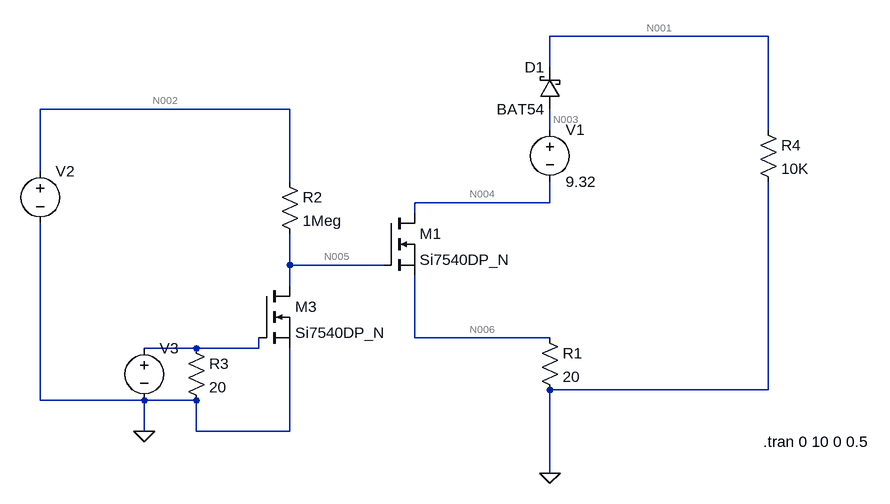
[diagram p0: schematic 1_solar_bank_cutoff_simu.asc]
1_solar_bank_cutoff_simu.asc, the LTspice schematic file:
Version 4
SHEET 1 880 680
WIRE 496 -96 160 -96
WIRE 160 -48 160 -96
WIRE -240 16 -624 16
WIRE 160 48 160 16
WIRE 496 48 496 -96
WIRE -624 112 -624 16
WIRE -240 128 -240 16
WIRE 160 160 160 128
WIRE 160 160 -48 160
WIRE -48 176 -48 160
WIRE -240 256 -240 208
WIRE -96 256 -240 256
WIRE -240 288 -240 256
WIRE -48 368 -48 272
WIRE 160 368 -48 368
WIRE -384 384 -464 384
WIRE -288 384 -288 368
WIRE -288 384 -384 384
WIRE 496 448 496 128
WIRE 496 448 160 448
WIRE -624 464 -624 192
WIRE -464 464 -624 464
WIRE -384 464 -464 464
WIRE -464 512 -464 464
WIRE -384 512 -384 464
WIRE -240 512 -240 384
WIRE -240 512 -384 512
WIRE 160 576 160 448
FLAG 160 576 0
FLAG -464 512 0
SYMBOL voltage 160 32 R0
WINDOW 123 0 0 Left 0
WINDOW 39 0 0 Left 0
SYMATTR InstName V1
SYMATTR Value 9.32
SYMBOL res 144 352 R0
SYMATTR InstName R1
SYMATTR Value 20
SYMATTR SpiceLine tol=1 pwr=0.1
SYMBOL nmos -288 288 R0
SYMATTR InstName M3
SYMATTR Value Si7540DP_N
SYMBOL schottky 176 16 R180
WINDOW 0 24 64 Left 2
WINDOW 3 24 0 Left 2
SYMATTR InstName D1
SYMATTR Value BAT54
SYMBOL voltage -464 368 R0
WINDOW 3 24 96 Invisible 2
WINDOW 39 0 0 Left 0
SYMATTR Value PULSE(0 3.3 0 0 0 1 2 10)
SYMATTR InstName V3
SYMATTR Value2 AC 1
SYMBOL res -256 112 R0
SYMATTR InstName R2
SYMATTR Value 1Meg
SYMATTR SpiceLine tol=1 pwr=0.1
SYMBOL res -400 368 R0
SYMATTR InstName R3
SYMATTR Value 20
SYMATTR SpiceLine tol=1 pwr=0.1
SYMBOL nmos -96 176 R0
SYMATTR InstName M1
SYMATTR Value Si7540DP_N
SYMBOL voltage -624 96 R0
WINDOW 3 24 96 Invisible 2
WINDOW 39 0 0 Left 0
SYMATTR Value 9
SYMATTR InstName V2
SYMBOL res 480 32 R0
SYMATTR InstName R4
SYMATTR Value 10K
SYMATTR SpiceLine tol=1 pwr=0.1
TEXT 488 528 Left 2 !.tran 0 10 0 0.5

The netlist it stands for:
* 1_solar_bank_cutoff_simu.asc
V1 N003 N004 9.32
R1 N006 0 20 tol=1 pwr=0.1
M3 N005 N007 0 0 Si7540DP_N
D1 N003 N001 BAT54
V3 N007 0 PULSE(0 3.3 0 0 0 1 2 10) AC 1
R2 N002 N005 1Meg tol=1 pwr=0.1
R3 N007 0 20 tol=1 pwr=0.1
M1 N004 N005 N006 N006 Si7540DP_N
V2 N002 0 9
R4 N001 0 10K tol=1 pwr=0.1
.model D D
.lib standard.dio
.model NMOS NMOS
.model PMOS PMOS
.lib standard.mos
.tran 0 10 0 0.5
.backanno
.end

* Results of the author's LTspice run, read from the files saved beside the schematic
* Operating Point, zero values left out:
*   V(n003) = 9.302 V
*   V(n004) = -18.14 mV
*   V(n006) = -18.13 mV
*   V(n005) = 9 V
*   V(n001) = 9.064 V
*   V(n002) = 9 V
*   Id(M1) = -906.4 µA
*   Is(M1) = 906.4 µA
*   Id(M3) = 33.1 pA
*   Is(M3) = -33.1 pA
*   I(D1) = 906.4 µA
*   I(R4) = 906.4 µA
*   I(R2) = 42.21 pA
*   I(R1) = -906.4 µA
*   I(V2) = -42.21 pA
*   I(V1) = -906.4 µA
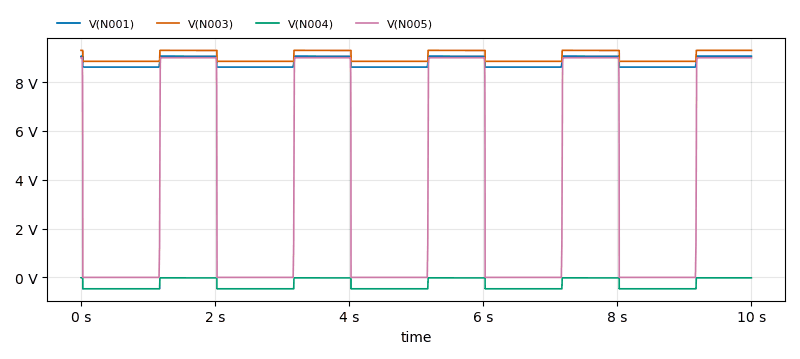
[diagram p1: Transient Analysis of 1_solar_bank_cutoff_simu.asc, plotted from the saved traces]
* Transient Analysis, 1 run:
*   V(N001): min 8.616 V, max 9.064 V, average 8.808 V, rms 8.811 V, last 9.064 V
*   V(N003): min 8.853 V, max 9.302 V, average 9.044 V, rms 9.047 V, last 9.302 V
*   V(N004): min -467.4 mV, max -18.1 mV, average -275.6 mV, rms 354 mV, last -18.14 mV
*   V(N005): min 0 V, max 9.005 V, average 3.827 V, rms 5.858 V, last 9 V